# Altium project CW330_NewKintexFPGA.PrjPcb (part 5 of 5)
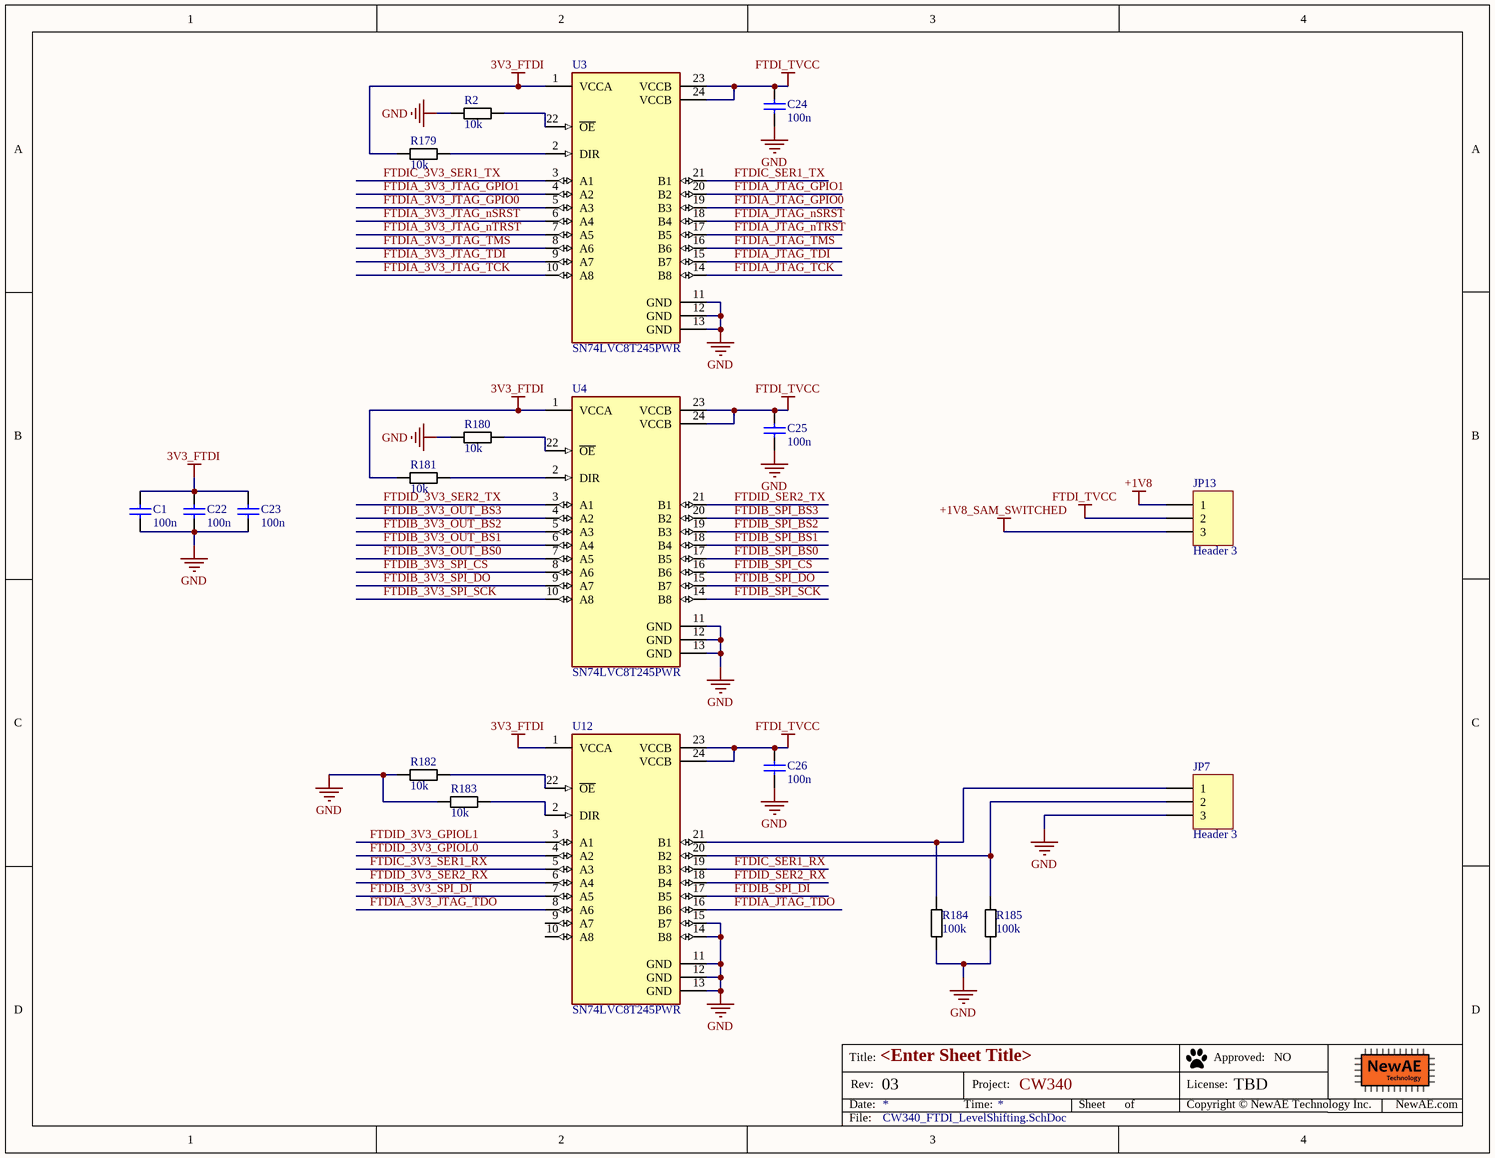
[diagram p26: CW340_FTDI_LevelShifting.SchDoc]

## Nets that join several sheets
+1V2: CW340_PSU_VCCIO (6 pins), CW340_USERIO_Header (JP9.5), CW340_EdgeConnector (J30.B09)
+1V8: CW340_FPGA_CFG (6 pins), CW340_Clocks (C28.1 C30.1 U15.6 U16.6), CW340_HEATSINK_FAN (R200.1), CW340_PSU_VCCAUX (6 pins), CW340_STATUS_LEDs (R8.2 R14.1 R227.1 R228.1), CW340_USERIO_debug (9 pins), CW340_USERIO_Header (JP9.3), CW340_USERIO_USB (C248.1 R235.2 R237.2 U17.9), CW340_USERIO_SerialSelections (J23.14), CW340_SPI_flashes (J6.2 J35.14 JP6.2), CW340_EdgeConnector (J30.A07 J30.A08), CW340_FTDI_LevelShifting (JP13.1)
+1V8_SAM_SWITCHED: CW340_FPGA_XADC (R160.1), CW340_SAM3X_MISC (7 pins), CW340_FTDI_LevelShifting (JP13.3)
+1V8_SAM_VDDBU: CW340_SAM3X_MAIN (J20.1), CW340_SAM3X_PWR (25 pins), CW340_SAM3X_MISC (7 pins), CW340_SAM3X_USB (R140.2 R142.1 U2.53)
+3V3: CW340_FPGA_CFG (D6.A D10.A), CW340_Clocks (C243.2 R78.1 U5.8), CW340_PSU_VCCIO (6 pins), CW340_STATUS_LEDs (C27.1 U26.1), CW340_USERIO_Header (JP9.1), CW340_USERIO_USB (6 pins), CW340_EdgeConnector (J30.A03 J30.A04), CW340_HyperDebug (R186.1)
+3V3_SAM_SWITCHED: CW340_Clocks (C242.2 U5.1 U5.6), CW340_FPGA_XADC (C166.1 R161.1 U22.2), CW340_SAM3X_MAIN (R34.2 R59.2 R306.2), CW340_SAM3X_MISC (6 pins)
+3V3_SAM_VDDANA: CW340_USBHUB (14 pins), CW340_SAM3X_MAIN (R178.2 R210.2 R212.2), CW340_SAM3X_PWR (11 pins), CW340_SAM3X_MISC (Q1.2 R71.1), CW340_SAM3X_USB (C120.1 R139.2 U2.75), CW340_FTDI (21 pins), CW340_FTDI_LevelShifting (8 pins)
+5V: CW340_HEATSINK_FAN (L1.2), CW340_INPUT_POWER (11 pins), CW340_PSU_VCCIO (12 pins), CW340_PSU_VCCAUX (8 pins), CW340_USBHUB_ExtPorts (SJ1.2), CW340_SAM3X_PWR (D2.A), CW340_SAM3X_MISC (Q14.2 R162.1), CW340_USERIO_USB (C244.1 U7.5), CW340_EdgeConnector (J30.B03 J30.B04 J30.B05 J30.B06), CW340_HyperDebug (P2.1)
+VCCIOB: CW340_STATUS_LEDs (R6.1), CW340_USERIO_Header (8 pins), CW340_USERIO_Breakout (J1.14), CW340_EdgeConnector (J30.B11)
GND: CW340_FPGA_CFG (5 pins), CW340_Clocks (27 pins), CW340_FPGA_XADC (5 pins), CW340_HEATSINK_FAN (9 pins), CW340_INPUT_POWER (31 pins), CW340_PSU_VCCIO (26 pins), CW340_PSU_VCCAUX (18 pins), CW340_USBHUB (31 pins), CW340_USBHUB_ExtPorts (17 pins), CW340_SAM3X_MAIN (14 pins), CW340_SAM3X_PWR (39 pins), CW340_SAM3X_MISC (12 pins), CW340_SAM3X_USB (17 pins), CW340_STATUS_LEDs (25 pins), CW340_USERIO_debug (34 pins), CW340_USERIO_Header (10 pins), CW340_USERIO_USB (21 pins), CW340_USERIO_SerialSelections (12 pins), CW340_USERIO_Breakout (8 pins), CW340_SPI_flashes (8 pins), CW340_EdgeConnector (30 pins), CW340_HyperDebug (15 pins), CW340_FTDI (46 pins), CW340_FTDI_LevelShifting (24 pins)
VUSB_USBC: CW340_INPUT_POWER (SW7.2), CW340_USBHUB (C74.1 R145.1 R170.1), CW340_USBHUB_ExtPorts (SJ2.2), CW340_SAM3X_PWR (C77.1 Q3.2 R111.1), CW340_SAM3X_USB (R135.2)
XADC_AGND: CW340_USERIO_Breakout (J5.10), CW340_EdgeConnector (J30.A16 J30.B16)
/USB_CE: CW340_Clocks (JP8.3), CW340_SAM3X_MAIN (R152.1), CW340_USERIO_Breakout (J4.25), CW340_EdgeConnector (J30.A81)
/USB_RD: CW340_SAM3X_MAIN (R310.1), CW340_USERIO_Breakout (J4.27), CW340_EdgeConnector (J30.A80)
/USB_WR: CW340_FPGA_CFG (R30.2), CW340_SAM3X_MAIN (R272.4A)
CFG_CLK: CW340_FPGA_CFG (R30.1 R198.1), CW340_USERIO_Breakout (J4.1), CW340_EdgeConnector (J30.A57)
CFG_D0: CW340_SAM3X_MAIN (R269.1A), CW340_USERIO_Breakout (J4.3), CW340_EdgeConnector (J30.A59)
CFG_D1: CW340_FPGA_CFG (R1.1), CW340_SAM3X_MAIN (R269.2A), CW340_USERIO_Breakout (J4.4), CW340_EdgeConnector (J30.B61)
CFG_D2: CW340_SAM3X_MAIN (R277.1), CW340_USERIO_Breakout (J4.5), CW340_EdgeConnector (J30.A60)
CFG_D3: CW340_SAM3X_MAIN (R269.3A), CW340_USERIO_Breakout (J4.6), CW340_EdgeConnector (J30.B62)
CFG_D4: CW340_SAM3X_MAIN (R269.4A), CW340_USERIO_Breakout (J4.7), CW340_EdgeConnector (J30.A61)
CFG_D5: CW340_SAM3X_MAIN (R267.1A), CW340_USERIO_Breakout (J4.8), CW340_EdgeConnector (J30.B63)
CFG_D6: CW340_SAM3X_MAIN (R267.2A), CW340_USERIO_Breakout (J4.9), CW340_EdgeConnector (J30.A62)
CFG_D7: CW340_SAM3X_MAIN (R267.3A), CW340_USERIO_Breakout (J4.10), CW340_EdgeConnector (J30.B64)
CFG_D8_A0: CW340_SAM3X_MAIN (R278.1), CW340_USERIO_Breakout (J4.11), CW340_EdgeConnector (J30.A63)
CFG_D9_A1: CW340_SAM3X_MAIN (R268.1A), CW340_USERIO_Breakout (J4.12), CW340_EdgeConnector (J30.B65)
CFG_D10_A2: CW340_SAM3X_MAIN (R268.2A), CW340_USERIO_Breakout (J4.13), CW340_EdgeConnector (J30.A64)
CFG_D11_A3: CW340_SAM3X_MAIN (R268.3A), CW340_USERIO_Breakout (J4.14), CW340_EdgeConnector (J30.B66)
CFG_D12_A4: CW340_SAM3X_MAIN (R268.4A), CW340_USERIO_Breakout (J4.15), CW340_EdgeConnector (J30.A65)
CFG_D13_A5: CW340_SAM3X_MAIN (R272.1A), CW340_USERIO_Breakout (J4.16), CW340_EdgeConnector (J30.B67)
CFG_D14_A6: CW340_SAM3X_MAIN (R272.2A), CW340_USERIO_Breakout (J4.17), CW340_EdgeConnector (J30.A66)
CFG_D15_A7: CW340_SAM3X_MAIN (R272.3A), CW340_USERIO_Breakout (J4.18), CW340_EdgeConnector (J30.B68)
CFG_DONE: CW340_FPGA_CFG (Q7.1 R201.2), CW340_SAM3X_MAIN (U2.88), CW340_USERIO_Breakout (J4.19), CW340_EdgeConnector (J30.A68)
CFG_DOUT: CW340_USERIO_Breakout (J4.20), CW340_EdgeConnector (J30.B70)
CFG_EMCCLK: CW340_USERIO_Breakout (J4.22), CW340_EdgeConnector (J30.B71)
CFG_INITB: CW340_FPGA_CFG (Q8.1 R202.2), CW340_SAM3X_MAIN (U2.89), CW340_USERIO_Breakout (J4.23), CW340_EdgeConnector (J30.A70)
CFG_PGM: CW340_FPGA_CFG (R203.2), CW340_SAM3X_MAIN (U2.90), CW340_USERIO_Breakout (J4.21), CW340_EdgeConnector (J30.A69)
CFG_RDWR: CW340_SAM3X_MAIN (R173.1), CW340_USERIO_Breakout (J4.24), CW340_EdgeConnector (J30.A78)
CW_OT_POR: CW340_USERIO_debug (Q25.1), CW340_USERIO_Header (R243.1)
CWIO_HS1: CW340_USERIO_Header (R242.2 TP14.1), CW340_EdgeConnector (J30.A27)
CWIO_HS2: CW340_USERIO_Header (R244.2 TP15.1), CW340_EdgeConnector (J30.B27)
CWIO_IO4: CW340_USERIO_Header (R253.2 TP12.1), CW340_EdgeConnector (J30.B26)
DISPLAY_BUSY: CW340_SAM3X_MAIN (U2.16), CW340_SAM3X_MISC (R164.2 R166.1)
DISPLAY_nRST: CW340_SAM3X_MAIN (U2.19), CW340_SAM3X_MISC (Q13.1)
DISPLAY_ON: CW340_SAM3X_MAIN (U2.20), CW340_SAM3X_MISC (Q15.1)
DISPLAY_TX: CW340_SAM3X_MAIN (U2.17), CW340_SAM3X_MISC (Q12.1)
FAN_PWM: CW340_HEATSINK_FAN (Q5.1 R200.2), CW340_SAM3X_MAIN (U2.144)
FPGA_M0: CW340_FPGA_CFG (R192.2), CW340_SAM3X_MAIN (U2.71), CW340_EdgeConnector (J30.B79)
FPGA_M1: CW340_FPGA_CFG (R193.2), CW340_SAM3X_MAIN (U2.72), CW340_EdgeConnector (J30.B80)
FPGA_M2: CW340_FPGA_CFG (R194.2), CW340_SAM3X_MAIN (U2.107), CW340_EdgeConnector (J30.B81)
FTDI_N: CW340_USBHUB (U1.3), CW340_FTDI (U9.7)
FTDI_P: CW340_USBHUB (U1.4), CW340_FTDI (U9.8)
FTDI_USB_EN: CW340_USBHUB (U1.16), CW340_FTDI (R19.2)
FTDIA_3V3_JTAG_GPIO0: CW340_FTDI (U9.23), CW340_FTDI_LevelShifting (U3.5)
FTDIA_3V3_JTAG_GPIO1: CW340_FTDI (U9.24), CW340_FTDI_LevelShifting (U3.4)
FTDIA_3V3_JTAG_nSRST: CW340_FTDI (U9.22), CW340_FTDI_LevelShifting (U3.6)
FTDIA_3V3_JTAG_nTRST: CW340_FTDI (U9.21), CW340_FTDI_LevelShifting (U3.7)
FTDIA_3V3_JTAG_TCK: CW340_FTDI (U9.16), CW340_FTDI_LevelShifting (U3.10)
FTDIA_3V3_JTAG_TDI: CW340_FTDI (U9.17), CW340_FTDI_LevelShifting (U3.9)
FTDIA_3V3_JTAG_TDO: CW340_FTDI (U9.18), CW340_FTDI_LevelShifting (U12.8)
FTDIA_3V3_JTAG_TMS: CW340_FTDI (U9.19), CW340_FTDI_LevelShifting (U3.8)
FTDIA_JTAG_GPIO0: CW340_USERIO_debug (JP11.2), CW340_FTDI_LevelShifting (U3.19)
FTDIA_JTAG_GPIO1: CW340_USERIO_debug (JP12.2), CW340_FTDI_LevelShifting (U3.20)
FTDIA_JTAG_nSRST: CW340_USERIO_debug (J10.15), CW340_FTDI_LevelShifting (U3.18)
FTDIA_JTAG_nTRST: CW340_USERIO_debug (J10.3), CW340_FTDI_LevelShifting (U3.17)
FTDIA_JTAG_TCK: CW340_USERIO_debug (J10.9), CW340_FTDI_LevelShifting (U3.14)
FTDIA_JTAG_TDI: CW340_USERIO_debug (J10.5), CW340_FTDI_LevelShifting (U3.15)
FTDIA_JTAG_TDO: CW340_USERIO_debug (J10.13), CW340_FTDI_LevelShifting (U12.16)
FTDIA_JTAG_TMS: CW340_USERIO_debug (J10.7), CW340_FTDI_LevelShifting (U3.16)
FTDIB_3V3_OUT_BS0: CW340_FTDI (U9.30), CW340_FTDI_LevelShifting (U4.7)
FTDIB_3V3_OUT_BS1: CW340_FTDI (U9.32), CW340_FTDI_LevelShifting (U4.6)
FTDIB_3V3_OUT_BS2: CW340_FTDI (U9.33), CW340_FTDI_LevelShifting (U4.5)
FTDIB_3V3_OUT_BS3: CW340_FTDI (SW11.4 U9.34), CW340_FTDI_LevelShifting (U4.4)
FTDIB_3V3_SPI_CS: CW340_FTDI (U9.29), CW340_FTDI_LevelShifting (U4.8)
FTDIB_3V3_SPI_DI: CW340_FTDI (U9.28), CW340_FTDI_LevelShifting (U12.7)
FTDIB_3V3_SPI_DO: CW340_FTDI (U9.27), CW340_FTDI_LevelShifting (U4.9)
FTDIB_3V3_SPI_SCK: CW340_FTDI (U9.26), CW340_FTDI_LevelShifting (U4.10)
FTDIB_SPI_BS0: CW340_USERIO_SerialSelections (J27.10), CW340_FTDI_LevelShifting (U4.17)
FTDIB_SPI_BS1: CW340_USERIO_SerialSelections (J27.11), CW340_FTDI_LevelShifting (U4.18)
FTDIB_SPI_BS2: CW340_USERIO_SerialSelections (J27.12), CW340_FTDI_LevelShifting (U4.19)
FTDIB_SPI_BS3: CW340_USERIO_SerialSelections (J27.13), CW340_FTDI_LevelShifting (U4.20)
FTDIB_SPI_CS: CW340_USERIO_SerialSelections (J27.9), CW340_FTDI_LevelShifting (U4.16)
FTDIB_SPI_DI: CW340_USERIO_SerialSelections (J27.3), CW340_FTDI_LevelShifting (U12.17)
FTDIB_SPI_DO: CW340_USERIO_SerialSelections (J27.2), CW340_FTDI_LevelShifting (U4.15)
FTDIB_SPI_SCK: CW340_USERIO_SerialSelections (J27.8), CW340_FTDI_LevelShifting (U4.14)
FTDIC_3V3_SER1_RX: CW340_FTDI (U9.39), CW340_FTDI_LevelShifting (U12.5)
FTDIC_3V3_SER1_TX: CW340_FTDI (U9.38), CW340_FTDI_LevelShifting (U3.3)
FTDIC_SER1_RX: CW340_USERIO_SerialSelections (JP2.2), CW340_FTDI_LevelShifting (U12.19)
FTDIC_SER1_TX: CW340_USERIO_SerialSelections (JP1.2), CW340_FTDI_LevelShifting (U3.21)
FTDID_3V3_GPIOL0: CW340_FTDI (U9.55), CW340_FTDI_LevelShifting (U12.4)
FTDID_3V3_GPIOL1: CW340_FTDI (U9.57), CW340_FTDI_LevelShifting (U12.3)
FTDID_3V3_SER2_RX: CW340_FTDI (U9.52), CW340_FTDI_LevelShifting (U12.6)
FTDID_3V3_SER2_TX: CW340_FTDI (U9.48), CW340_FTDI_LevelShifting (U4.3)
FTDID_SER2_RX: CW340_USERIO_SerialSelections (JP4.2), CW340_FTDI_LevelShifting (U12.18)
FTDID_SER2_TX: CW340_USERIO_SerialSelections (JP3.2), CW340_FTDI_LevelShifting (U4.21)
HD_CC1_ALT: CW340_USERIO_Breakout (J5.3), CW340_HyperDebug (R47.1)
HD_CC2_ALT: CW340_USERIO_Breakout (J5.4), CW340_HyperDebug (R48.2)
HD_IOC0: CW340_USERIO_SerialSelections (J25.10), CW340_HyperDebug (R97.1)
HD_IOC1: CW340_USERIO_SerialSelections (J25.11), CW340_HyperDebug (R99.1)
HD_IOC2: CW340_USERIO_SerialSelections (J25.12), CW340_HyperDebug (R101.1)
HD_IOC5: CW340_USERIO_debug (JP11.6), CW340_HyperDebug (R83.2)
HD_IOC8: CW340_USERIO_debug (JP12.6), CW340_HyperDebug (R84.2)
HD_IOR0_TMS: CW340_USERIO_debug (J12.7), CW340_HyperDebug (R40.1)
HD_IOR1_TDO: CW340_USERIO_debug (J12.13), CW340_HyperDebug (R36.1)
HD_IOR2_TDI: CW340_USERIO_debug (J12.5), CW340_HyperDebug (R33.1)
HD_IOR3_TCK: CW340_USERIO_debug (J12.9), CW340_HyperDebug (R32.1)
HD_IOR4_TRST: CW340_USERIO_debug (J12.3), CW340_HyperDebug (R57.2)
HD_RXD0: CW340_USERIO_SerialSelections (JP2.6), CW340_HyperDebug (R87.2)
HD_RXD1: CW340_USERIO_SerialSelections (JP4.6), CW340_HyperDebug (R58.2)
HD_SPI_DEV_CLK: CW340_USERIO_SerialSelections (J25.8), CW340_HyperDebug (R118.2)
HD_SPI_DEV_CS_L: CW340_USERIO_SerialSelections (J25.9), CW340_HyperDebug (R91.2)
HD_SPI_DEV_D0: CW340_USERIO_SerialSelections (J25.2), CW340_HyperDebug (R117.1)
HD_SPI_DEV_D1: CW340_USERIO_SerialSelections (J25.3), CW340_HyperDebug (R95.2)
HD_SPI_DEV_D2: CW340_USERIO_SerialSelections (J25.5), CW340_HyperDebug (R121.1)
HD_SPI_DEV_D3: CW340_USERIO_SerialSelections (J25.6), CW340_HyperDebug (R105.1)
HD_TXD0: CW340_USERIO_SerialSelections (JP1.6), CW340_HyperDebug (R90.2)
HD_TXD1: CW340_USERIO_SerialSelections (JP3.6), CW340_HyperDebug (R56.2)
J8_5V: CW340_USBHUB_ExtPorts (C101.1 J8.A4-B9 J8.B4-A9 U27.1), CW340_HyperDebug (P1.1)
JTAGSEL: CW340_SAM3X_MISC (J32.3), CW340_SAM3X_USB (R76.1 U2.46)
OT_ADC1: CW340_USERIO_Breakout (J5.7), CW340_EdgeConnector (J30.B12)
OT_ADC2: CW340_USERIO_Breakout (J5.8), CW340_EdgeConnector (J30.B13)
OT_ANALOG0_ADC3: CW340_USERIO_Breakout (J5.1), CW340_EdgeConnector (J30.B14)
OT_ANALOG1_ADC4: CW340_USERIO_Breakout (J5.2), CW340_EdgeConnector (J30.B15)
OT_IOA0: CW340_USERIO_SerialSelections (JP3.1 JP3.3 JP3.5), CW340_USERIO_Breakout (J2.1), CW340_EdgeConnector (J30.A29)
OT_IOA1: CW340_USERIO_SerialSelections (JP4.1 JP4.3 JP4.5), CW340_USERIO_Breakout (J2.2), CW340_EdgeConnector (J30.B29)
OT_IOA2: CW340_USERIO_Breakout (J2.3), CW340_EdgeConnector (J30.A30), CW340_HyperDebug (R124.1)
OT_IOA3: CW340_USERIO_Breakout (J2.4), CW340_EdgeConnector (J30.B30), CW340_HyperDebug (R60.2)
OT_IOA4: CW340_USERIO_Breakout (J2.5), CW340_EdgeConnector (J30.A31), CW340_HyperDebug (R63.2)
OT_IOA5: CW340_USERIO_Breakout (J2.6), CW340_EdgeConnector (J30.B31), CW340_HyperDebug (R75.2)
OT_IOA6: CW340_USERIO_Breakout (J2.7), CW340_EdgeConnector (J30.A32), CW340_HyperDebug (R67.2)
OT_IOA7: CW340_USERIO_Breakout (J2.8), CW340_EdgeConnector (J30.B32), CW340_HyperDebug (R197.2)
OT_IOA8: CW340_USERIO_Breakout (J2.9), CW340_EdgeConnector (J30.A33), CW340_HyperDebug (R196.2)
OT_IOB0: CW340_USERIO_Header (R289.1), CW340_USERIO_Breakout (J1.1), CW340_EdgeConnector (J30.A18), CW340_HyperDebug (SW9.16)
OT_IOB1: CW340_USERIO_Header (R290.2), CW340_USERIO_Breakout (J1.2), CW340_EdgeConnector (J30.B18), CW340_HyperDebug (SW9.15)
OT_IOB2: CW340_USERIO_Header (R291.1), CW340_USERIO_Breakout (J1.3), CW340_EdgeConnector (J30.A19), CW340_HyperDebug (SW9.14)
OT_IOB3: CW340_USERIO_Header (R292.2), CW340_USERIO_Breakout (J1.4), CW340_EdgeConnector (J30.B19), CW340_HyperDebug (SW9.13)
OT_IOB4: CW340_USERIO_Header (R247.2 R293.1), CW340_USERIO_Breakout (J1.5), CW340_EdgeConnector (J30.A20), CW340_HyperDebug (SW9.12)
OT_IOB5: CW340_USERIO_Header (R249.2 R294.2), CW340_USERIO_Breakout (J1.6), CW340_EdgeConnector (J30.B20), CW340_HyperDebug (SW9.11)
OT_IOB6: CW340_STATUS_LEDs (SW1.1), CW340_USERIO_Header (R251.2 R295.1), CW340_USERIO_Breakout (J1.7), CW340_EdgeConnector (J30.A21), CW340_HyperDebug (SW9.10)
OT_IOB7: CW340_STATUS_LEDs (SW1.2), CW340_USERIO_Header (R296.2), CW340_USERIO_Breakout (J1.8), CW340_EdgeConnector (J30.B21), CW340_HyperDebug (SW9.9)
OT_IOB8: CW340_STATUS_LEDs (SW1.3), CW340_USERIO_Header (R297.1), CW340_USERIO_Breakout (J1.9), CW340_EdgeConnector (J30.A22), CW340_HyperDebug (SW8.16)
OT_IOB9: CW340_STATUS_LEDs (SW1.4), CW340_USERIO_Header (R298.2), CW340_USERIO_Breakout (J1.10), CW340_EdgeConnector (J30.B22), CW340_HyperDebug (SW8.15)
OT_IOB10: CW340_STATUS_LEDs (SW1.5), CW340_USERIO_Header (R299.1), CW340_USERIO_Breakout (J1.11), CW340_EdgeConnector (J30.A23), CW340_HyperDebug (SW8.14)
OT_IOB11: CW340_STATUS_LEDs (SW1.6), CW340_USERIO_Header (R245.1 R300.2), CW340_USERIO_Breakout (J1.12), CW340_EdgeConnector (J30.B23), CW340_HyperDebug (SW8.13)
OT_IOB12: CW340_STATUS_LEDs (SW1.7), CW340_USERIO_Header (R246.1 R301.1), CW340_USERIO_Breakout (J1.13), CW340_EdgeConnector (J30.A24), CW340_HyperDebug (SW8.12)
OT_IOC0: CW340_USERIO_SerialSelections (R43.2), CW340_USERIO_Breakout (J7.1), CW340_EdgeConnector (J30.A50)
OT_IOC1: CW340_USERIO_SerialSelections (R44.1), CW340_USERIO_Breakout (J7.2), CW340_EdgeConnector (J30.B50)
OT_IOC2: CW340_USERIO_SerialSelections (R45.2), CW340_USERIO_Breakout (J7.3), CW340_EdgeConnector (J30.A51)
OT_IOC3: CW340_USERIO_SerialSelections (JP1.1 JP1.3 JP1.5), CW340_USERIO_Breakout (J7.4), CW340_EdgeConnector (J30.B51)
OT_IOC4: CW340_USERIO_SerialSelections (JP2.1 JP2.3 JP2.5), CW340_USERIO_Breakout (J7.5), CW340_EdgeConnector (J30.A52)
OT_IOC5: CW340_USERIO_debug (R41.1), CW340_USERIO_Breakout (J7.6), CW340_EdgeConnector (J30.B52)
OT_IOC6: CW340_USERIO_Breakout (J7.7), CW340_EdgeConnector (J30.B53), CW340_HyperDebug (R195.1)
OT_IOC7: CW340_USERIO_Breakout (J7.8), CW340_EdgeConnector (J30.B54), CW340_HyperDebug (R131.2)
OT_IOC8: CW340_USERIO_debug (R42.1), CW340_USERIO_Breakout (J7.9), CW340_EdgeConnector (J30.B55)
OT_IOC9: CW340_USERIO_Breakout (J7.10), CW340_SPI_flashes (J35.10), CW340_EdgeConnector (J30.B56), CW340_HyperDebug (R127.1)
OT_IOC10: CW340_USERIO_Breakout (J7.11), CW340_SPI_flashes (J35.11), CW340_EdgeConnector (J30.B57), CW340_HyperDebug (R128.1)
OT_IOC11: CW340_USERIO_Breakout (J7.12), CW340_SPI_flashes (J35.12), CW340_EdgeConnector (J30.B58), CW340_HyperDebug (R86.2)
OT_IOC12: CW340_USERIO_Breakout (J7.13), CW340_SPI_flashes (J35.13), CW340_EdgeConnector (J30.B59), CW340_HyperDebug (R88.2)
OT_IOR0_USR_DBG_TMS: CW340_USERIO_debug (J13.7 J29.2), CW340_USERIO_Breakout (J3.1), CW340_EdgeConnector (J30.A42)
OT_IOR1_USR_DBG_TDO: CW340_USERIO_debug (J13.13 J29.6), CW340_USERIO_Breakout (J3.2), CW340_EdgeConnector (J30.B42)
OT_IOR2_USR_DBG_TDI: CW340_USERIO_debug (J13.5 J29.8), CW340_USERIO_Breakout (J3.3), CW340_EdgeConnector (J30.A43)
OT_IOR3_USR_DBG_TCK: CW340_USERIO_debug (J13.9 J13.11 J29.4), CW340_USERIO_Breakout (J3.4), CW340_EdgeConnector (J30.B43)
OT_IOR4_USR_DBG_TRST: CW340_USERIO_debug (J13.3), CW340_USERIO_Breakout (J3.5), CW340_EdgeConnector (J30.A44)
OT_IOR5: CW340_STATUS_LEDs (SW1.8), CW340_USERIO_Breakout (J3.6), CW340_EdgeConnector (J30.B44), CW340_HyperDebug (R98.2)
OT_IOR6: CW340_STATUS_LEDs (SW2.1), CW340_USERIO_Breakout (J3.7), CW340_EdgeConnector (J30.A45), CW340_HyperDebug (R100.2)
OT_IOR7: CW340_STATUS_LEDs (SW2.2), CW340_USERIO_Breakout (J3.8), CW340_EdgeConnector (J30.B45), CW340_HyperDebug (R102.2)
OT_IOR8: CW340_STATUS_LEDs (SW2.3), CW340_USERIO_Breakout (J3.9), CW340_EdgeConnector (J30.A46), CW340_HyperDebug (R104.2)
OT_IOR9: CW340_STATUS_LEDs (SW2.4), CW340_USERIO_Breakout (J3.10), CW340_EdgeConnector (J30.B46), CW340_HyperDebug (R115.2)
OT_IOR10: CW340_STATUS_LEDs (SW2.5), CW340_USERIO_Breakout (J3.11), CW340_EdgeConnector (J30.A47), CW340_HyperDebug (R116.2)
OT_IOR11: CW340_STATUS_LEDs (SW2.6), CW340_USERIO_Breakout (J3.12), CW340_EdgeConnector (J30.B47), CW340_HyperDebug (R120.2)
OT_IOR12: CW340_STATUS_LEDs (SW2.7), CW340_USERIO_Breakout (J3.13), CW340_EdgeConnector (J30.A48), CW340_HyperDebug (R123.2)
OT_IOR13: CW340_STATUS_LEDs (SW2.8), CW340_USERIO_Breakout (J3.14), CW340_EdgeConnector (J30.B48), CW340_HyperDebug (R125.2)
OT_PORN: CW340_USERIO_debug (JP5.2 JP5.4 R260.2 R261.2), CW340_EdgeConnector (J30.A53), CW340_HyperDebug (R126.1)
OT_SPI_DEV_CLK: CW340_USERIO_SerialSelections (J23.8), CW340_EdgeConnector (J30.A35)
OT_SPI_DEV_CS_L: CW340_USERIO_SerialSelections (J23.9), CW340_EdgeConnector (J30.A40)
OT_SPI_DEV_D0: CW340_USERIO_SerialSelections (J23.2), CW340_EdgeConnector (J30.A36)
OT_SPI_DEV_D1: CW340_USERIO_SerialSelections (J23.3), CW340_EdgeConnector (J30.A37)
OT_SPI_DEV_D2: CW340_USERIO_SerialSelections (J23.5), CW340_EdgeConnector (J30.A38)
OT_SPI_DEV_D3: CW340_USERIO_SerialSelections (J23.6), CW340_EdgeConnector (J30.A39)
OT_SPI_HOST_CLK: CW340_SPI_flashes (J6.6 J35.8 SW12.5), CW340_EdgeConnector (J30.B35)
OT_SPI_HOST_CS_L: CW340_SPI_flashes (J6.1 J35.9 SW12.6), CW340_EdgeConnector (J30.B40)
OT_SPI_HOST_D0: CW340_SPI_flashes (J6.8 J35.2 SW12.1), CW340_EdgeConnector (J30.B36)
OT_SPI_HOST_D1: CW340_SPI_flashes (J6.3 J35.3 SW12.2), CW340_EdgeConnector (J30.B37)
OT_SPI_HOST_D2: CW340_SPI_flashes (J6.5 J35.5 SW12.3), CW340_EdgeConnector (J30.B38)
OT_SPI_HOST_D3: CW340_SPI_flashes (J6.4 J35.6 SW12.4), CW340_EdgeConnector (J30.B39)
PGOOD_1V2: CW340_PSU_VCCIO (R305.2), CW340_SAM3X_MAIN (R199.2 U2.123)
PGOOD_1V8: CW340_PSU_VCCAUX (R307.2), CW340_SAM3X_MAIN (R209.2 U2.127)
PGOOD_3V3: CW340_PSU_VCCIO (R280.2), CW340_SAM3X_MAIN (R226.2 U2.129)
PGOOD_VCCINT: CW340_SAM3X_MAIN (R211.2 R254.1 U2.128), CW340_EdgeConnector (J30.B10)
PLL_CLK1: CW340_Clocks (U15.4), CW340_EdgeConnector (J30.A55)
PLL_CLK2: CW340_Clocks (JP8.2 U16.4), CW340_EdgeConnector (J30.B33)
PLL_SCL: CW340_Clocks (U25.10), CW340_FPGA_XADC (U22.14), CW340_SAM3X_MISC (R207.2 U21.8), CW340_EdgeConnector (J30.A12)
PLL_SDA: CW340_Clocks (U25.9), CW340_FPGA_XADC (U22.12), CW340_SAM3X_MISC (R206.2 U21.1), CW340_EdgeConnector (J30.A11)
PMOD2_IO4_3V3: CW340_USERIO_Header (R248.1 R303.1), CW340_EdgeConnector (J30.A25)
PMOD2_IO7_3V3: CW340_USERIO_Header (R250.1 R302.2), CW340_EdgeConnector (J30.B25)
PMOD2_IO8_3V3: CW340_USERIO_Header (R252.1 R304.2), CW340_EdgeConnector (J30.A26)
PWRON: CW340_PSU_VCCAUX (S1.6), CW340_SAM3X_MAIN (U2.68)
QUIET_MODE: CW340_SAM3X_MAIN (U2.13), CW340_SAM3X_USB (SW10.5)
SAM3PWRON: CW340_SAM3X_MAIN (U2.83), CW340_SAM3X_MISC (Q4.1 R17.2)
SAM3X_N: CW340_USBHUB (U1.1), CW340_SAM3X_USB (R137.2 U2.38)
SAM3X_OT_POR: CW340_SAM3X_MAIN (U2.103), CW340_USERIO_debug (Q24.1)
SAM3X_P: CW340_USBHUB (U1.2), CW340_SAM3X_USB (R136.2 U2.37)
SAM3X_USB_EN: CW340_USBHUB (U1.12), CW340_SAM3X_USB (Q10.1 R133.1)
SAM3X_VBUS_DETECT: CW340_SAM3X_MAIN (U2.14), CW340_SAM3X_USB (R133.2 R134.1)
SAM_FPGA_CCLK: CW340_FPGA_CFG (R198.2), CW340_SAM3X_MAIN (U2.143)
SAM_FPGA_COPI: CW340_FPGA_CFG (R1.2), CW340_SAM3X_MAIN (U2.91)
SAM_JTAGSTRAP0: CW340_SAM3X_MAIN (U2.87), CW340_USERIO_debug (JP11.4)
SAM_JTAGSTRAP1: CW340_SAM3X_MAIN (U2.86), CW340_USERIO_debug (JP12.4)
SAM_nRST: CW340_SAM3X_MISC (J32.10), CW340_SAM3X_USB (6 pins)
SAM_RXD0: CW340_SAM3X_MAIN (R265.1A), CW340_USERIO_SerialSelections (JP2.4)
SAM_RXD1: CW340_SAM3X_MAIN (R265.3A), CW340_USERIO_SerialSelections (JP4.4)
SAM_TCK: CW340_SAM3X_MAIN (U2.28), CW340_SAM3X_MISC (J32.4 R108.2)
SAM_TDI: CW340_SAM3X_MAIN (U2.29), CW340_SAM3X_MISC (J32.8 R110.2)
SAM_TDO: CW340_SAM3X_MAIN (U2.30), CW340_SAM3X_MISC (J32.6 R109.2)
SAM_TMS: CW340_SAM3X_MAIN (U2.31), CW340_SAM3X_MISC (J32.2 R107.2)
SAM_TXD0: CW340_SAM3X_MAIN (R265.2A), CW340_USERIO_SerialSelections (JP1.4)
SAM_TXD1: CW340_SAM3X_MAIN (R265.4A), CW340_USERIO_SerialSelections (JP3.4)
SCL_1v8: CW340_SAM3X_MAIN (U2.70), CW340_SAM3X_MISC (R15.2 U21.5)
SDA_1v8: CW340_SAM3X_MAIN (U2.9), CW340_SAM3X_MISC (R16.2 U21.4)
SW_STATE: CW340_Clocks (U25.1), CW340_PSU_VCCIO (U10.15 U11.15), CW340_PSU_VCCAUX (R68.1 S1.5 U24.15 U28.1), CW340_SAM3X_MAIN (U2.1), CW340_EdgeConnector (J30.A13)
TEMP_ALERT_N: CW340_FPGA_XADC (R160.2 U22.11), CW340_SAM3X_MAIN (U2.80)
USB1EN: CW340_USBHUB (U1.18), CW340_USBHUB_ExtPorts (U20.4)
USB1OC: CW340_USBHUB (U1.19), CW340_USBHUB_ExtPorts (U20.3)
USB2EN: CW340_USBHUB (U1.20), CW340_USBHUB_ExtPorts (U27.4)
USB2OC: CW340_USBHUB (U1.21), CW340_USBHUB_ExtPorts (U27.3)
USB_C_3_CC1: CW340_USERIO_USB (5 pins), CW340_USERIO_Breakout (J5.5)
USB_C_3_CC2: CW340_USERIO_USB (5 pins), CW340_USERIO_Breakout (J5.6)
USB_CLK0: CW340_SAM3X_MAIN (R276.2), CW340_USERIO_Breakout (J4.26), CW340_EdgeConnector (J30.A79)
USB_SPI_CIPO: CW340_SAM3X_MAIN (R309.1A), CW340_USERIO_SerialSelections (J24.3)
USB_SPI_COPI: CW340_SAM3X_MAIN (R309.2A), CW340_USERIO_SerialSelections (J24.2)
USB_SPI_CS: CW340_SAM3X_MAIN (R309.4A), CW340_USERIO_SerialSelections (J24.9)
USB_SPI_SCK: CW340_SAM3X_MAIN (R309.3A), CW340_USERIO_SerialSelections (J24.8)
USBPORT1_N: CW340_USBHUB (U1.6), CW340_USBHUB_ExtPorts (J33.A7 J33.B7)
USBPORT1_P: CW340_USBHUB (U1.7), CW340_USBHUB_ExtPorts (J33.A6 J33.B6)
USBPORT2_N: CW340_USBHUB (U1.8), CW340_USBHUB_ExtPorts (J8.A7 J8.B7)
USBPORT2_P: CW340_USBHUB (U1.9), CW340_USBHUB_ExtPorts (J8.A6 J8.B6)
USBSPARE0: CW340_SAM3X_MAIN (R163.1A), CW340_USERIO_SerialSelections (J24.10)
USBSPARE1: CW340_SAM3X_MAIN (R163.2A), CW340_USERIO_SerialSelections (J24.11)
USBSPARE2: CW340_SAM3X_MAIN (R163.3A), CW340_USERIO_SerialSelections (J24.12)
USBSPARE3: CW340_SAM3X_MAIN (R163.4A), CW340_USERIO_SerialSelections (J24.13)
USR_DBG_nRST: CW340_USERIO_debug (J13.15 J29.10 JP5.3), CW340_EdgeConnector (J30.B41)
USRSW0: CW340_STATUS_LEDs (R228.2 USRSW0.1), CW340_USERIO_debug (JP5.1)
USRUSB_OE: CW340_USERIO_USB (R235.1 U17.3), CW340_EdgeConnector (J30.B77)
USRUSB_PWREN: CW340_USERIO_USB (R208.1 U7.4), CW340_EdgeConnector (J30.A72)
USRUSB_RCV: CW340_USERIO_USB (U17.4), CW340_EdgeConnector (J30.A76)
USRUSB_SOFTCN: CW340_USERIO_USB (U17.2), CW340_EdgeConnector (J30.B75)
USRUSB_SPD: CW340_USERIO_USB (U17.10), CW340_EdgeConnector (J30.B76)
USRUSB_SUS: CW340_USERIO_USB (R237.1 U17.7), CW340_EdgeConnector (J30.B78)
USRUSB_VBUS_DETECT: CW340_USERIO_USB (R205.2 R232.1), CW340_EdgeConnector (J30.A73)
USRUSB_VM: CW340_USERIO_USB (U17.6), CW340_EdgeConnector (J30.A74)
USRUSB_VMO: CW340_USERIO_USB (U17.14), CW340_EdgeConnector (J30.B74)
USRUSB_VP: CW340_USERIO_USB (U17.5), CW340_EdgeConnector (J30.A75)
USRUSB_VPO: CW340_USERIO_USB (U17.13), CW340_EdgeConnector (J30.B73)
VUSB_IN: CW340_INPUT_POWER (SW7.3), CW340_USBHUB (J28.A4-B9 J28.B4-A9 U6.4)
XADC_DXN: CW340_FPGA_XADC (C167.2 U22.4), CW340_EdgeConnector (J30.A15)
XADC_DXP: CW340_FPGA_XADC (C167.1 U22.3), CW340_EdgeConnector (J30.A14)